# EAGLE design Module_Motor_DC (EAGLE 9.6.2)
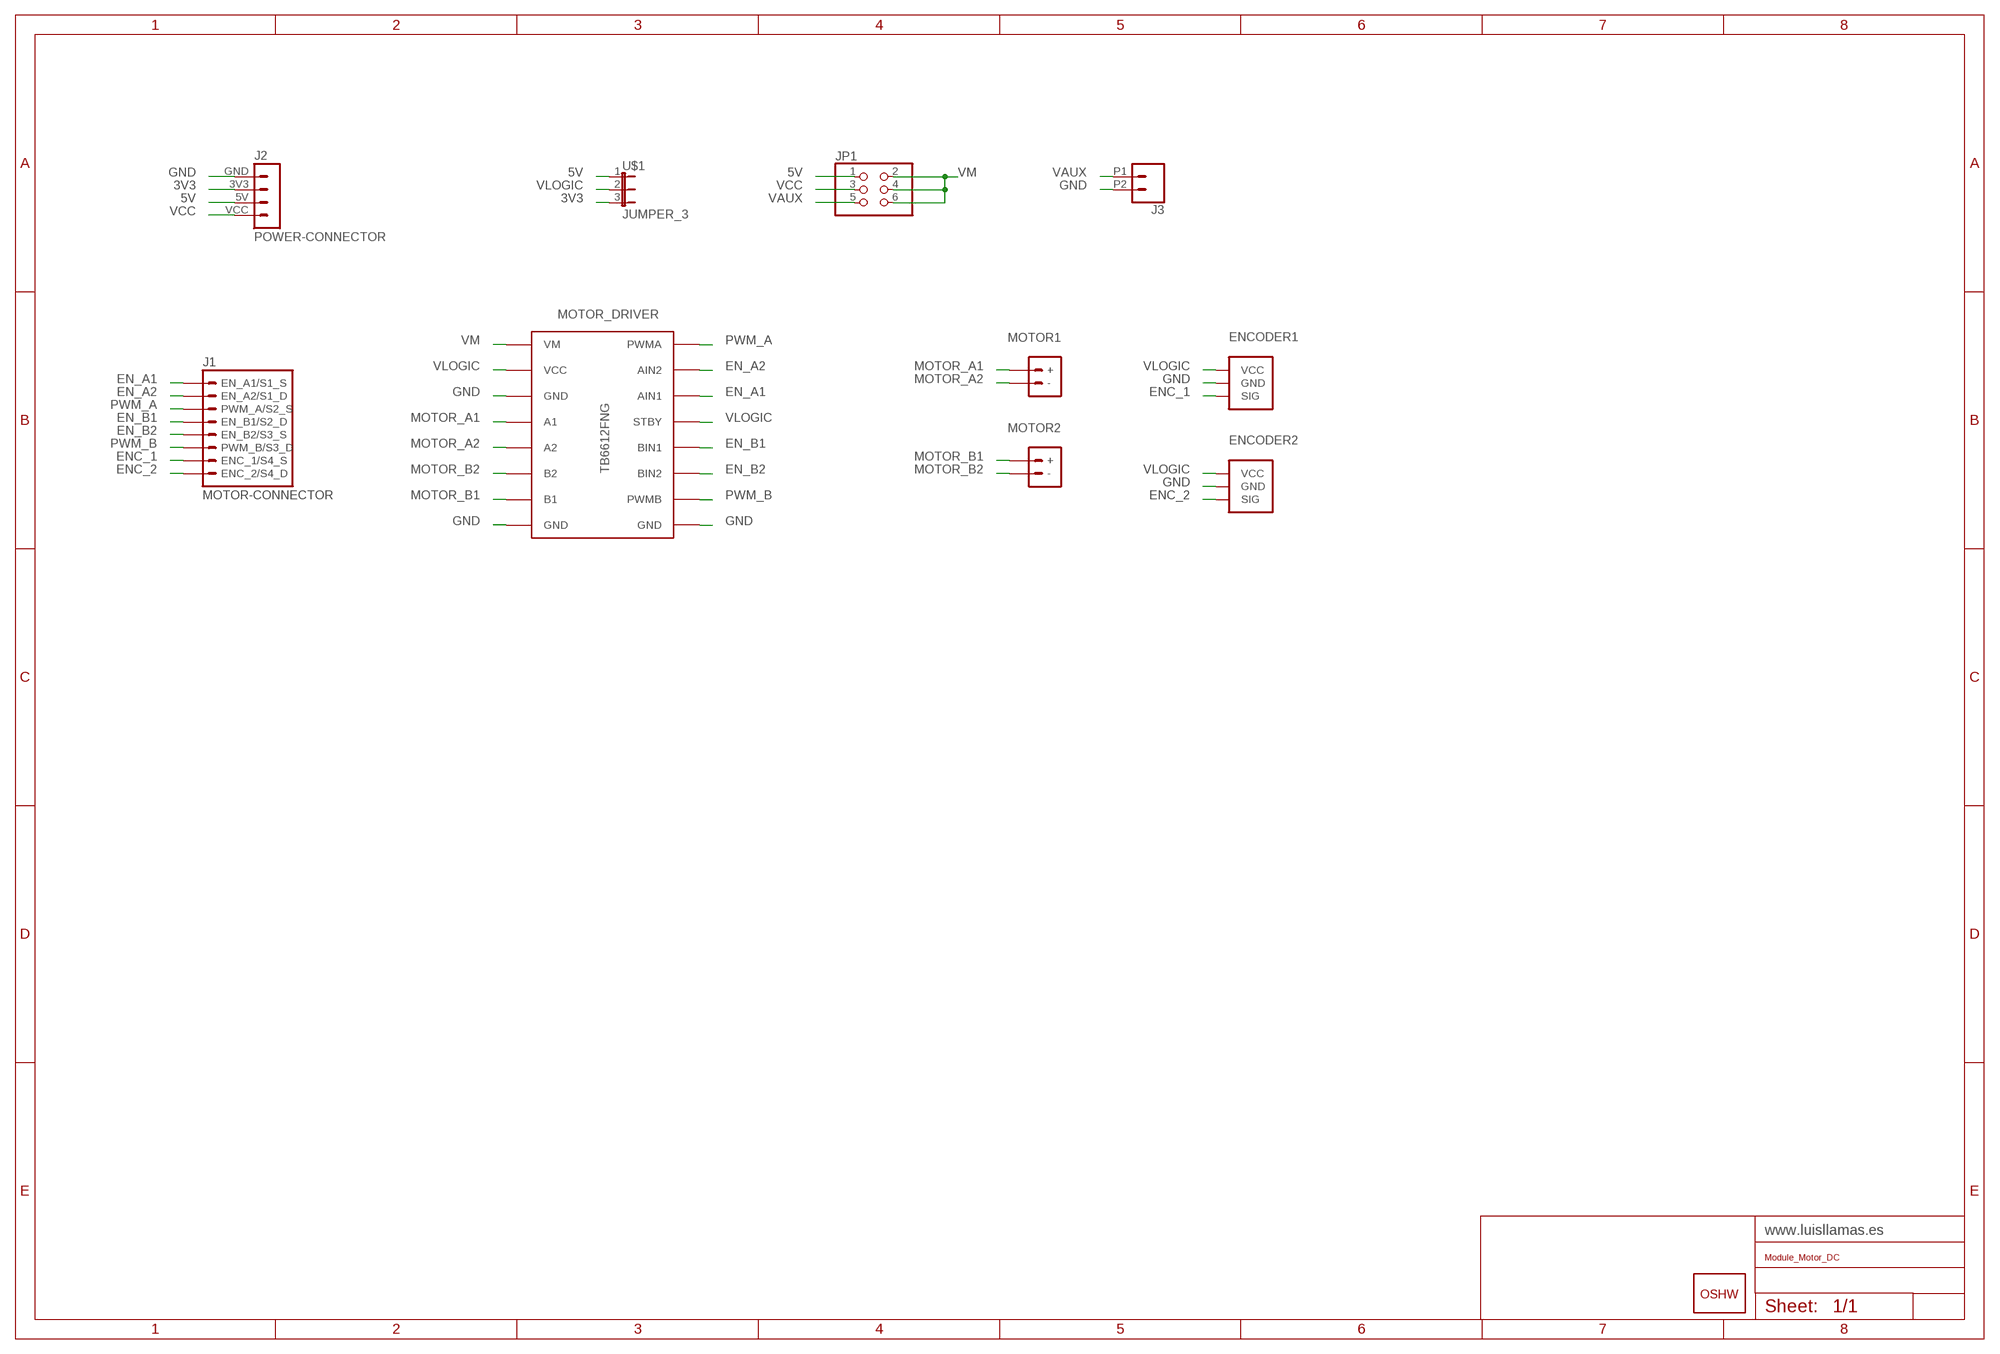
[diagram p0: schematic, sheet 1]

## Parts
ENCODER1  ENCODER/OCT  [ENCODER]
ENCODER2  ENCODER/OCT  [ENCODER]
GOLD_ORB_SM1  OSHWLOGO_GOLD_ORB_MED  [OSHW1]
J1  MOTOR-CONNECTOR  [MOTOR-CONNECTOR]
J2  POWER-CONNECTOR  [POWER-CONNECTOR]
J3  CONN_022.54MM_SCREWTERM  [1X02_2.54_SCREWTERM]
JP1  JUMPER_3X2/OCT  [JUMPER_3X2]
MOTOR1  MOTOR-TERMINAL5MM  [SCREWTERMINAL-5MM-2]
MOTOR2  MOTOR-TERMINAL5MM  [SCREWTERMINAL-5MM-2]
MOTOR_DRIVER  TB6612FNG  [TB6612FNG]
U$1  JUMPER_3  [JUMPER_3]

## Nets
3V3: J2.3V3 U$1.3
5V: J2.5V JP1.1 U$1.1
EN_A1: J1.EN_A1/S1_S MOTOR_DRIVER.AIN1
EN_A2: J1.EN_A2/S1_D MOTOR_DRIVER.AIN2
EN_B1: J1.EN_B1/S2_D MOTOR_DRIVER.BIN1
EN_B2: J1.EN_B2/S3_S MOTOR_DRIVER.BIN2
ENC_1: ENCODER1.SIG J1.ENC_1/S4_S
ENC_2: ENCODER2.SIG J1.ENC_2/S4_D
GND: ENCODER1.GND ENCODER2.GND J2.GND J3.P2 MOTOR_DRIVER.GND1(GND) MOTOR_DRIVER.GND2(GND) MOTOR_DRIVER.GND3(GND)
MOTOR_A1: MOTOR1.+ MOTOR_DRIVER.A1
MOTOR_A2: MOTOR1.- MOTOR_DRIVER.A2
MOTOR_B1: MOTOR2.+ MOTOR_DRIVER.B1
MOTOR_B2: MOTOR2.- MOTOR_DRIVER.B2
PWM_A: J1.PWM_A/S2_S MOTOR_DRIVER.PWMA
PWM_B: J1.PWM_B/S3_D MOTOR_DRIVER.PWMB
VAUX: J3.P1 JP1.5
VCC: J2.VCC JP1.3
VLOGIC: ENCODER1.VCC ENCODER2.VCC MOTOR_DRIVER.STBY MOTOR_DRIVER.VCC U$1.2
VM: JP1.2 JP1.4 JP1.6 MOTOR_DRIVER.VM

## Library data of the parts
ENCODER1 ENCODER2 = LLL_Headers:ENCODER: Header for Servo
GOLD_ORB_SM1 = LLL_Frames:OSHWLOGO: These are Open-Source Hardware logos.
J1 = LLL_Motors:MOTOR-CONNECTOR: MOTOR CONNECTOR 8p DC Motor EN_A1 EN_A2 PWM_A EN_B1 EN_B2 PWM_B ENC_1 ENC_2 Stepper STEP1_S STEP1_D STEP2_S STEP2_D STEP3_S STEP3_D STEP4_S STEP4_D
J2 = LLL_Power:POWER-CONNECTOR: JST Connector
J3 = LLL_Connectors:CONN_02: Multi connection point. Often used as Generic Header-pin footprint for 0.1 inch spaced/style header connections On any of the 0.1 inch spaced packages, you can populate with these: Break Away Headers - Straight <https://www.sparkfun.com/products/116> (PRT-00116) Break Away Male Headers - Right Angle <https://www.sparkfun.com/products/553> (PRT-00553) Female Headers <https://www.sparkfun.com/products/115> (PRT-00115) Break Away Headers - Machine Pin <https://www.sparkfun.com/products/117> (PRT-00117) Break Away Female Headers - Swiss Machine Pin <https://www.sparkfun.com/products/743> (PRT-00743) For SCREWTERMINALS and SPRING TERMINALS visit here: Screw Terimnals on SparkFun.com <https://www.sparkfun.com/search/results?term=Screw+Terminals> (5mm/3.5mm/2.54mm spacing) This device is also useful as a general connection point to wire up your design to another part of your project. Our various solder wires solder well into these plated through hole pads. Hook-Up Wire - Assortment (Stranded, 22 AWG) <https://www.sparkfun.com/products/11375> (PRT-11375) Hook-Up Wire - Assortment (Solid Core, 22 AWG) <https://www.sparkfun.com/products/11367> (PRT-11367) View the entire wire category on our website here <https://www.sparkfun.com/categories/141> Special notes: Molex polarized connector foot print use with: PRT-08233 with associated crimp pins and housings. 2.54_SCREWTERM for use with PRT-10571. 3.5mm Screw Terminal footprints for PRT-08084 5mm Screw Terminal footprints for use with PRT-08432
JP1 = LLL_Jumpers:JUMPER_3X2: Header ISR
MOTOR1 MOTOR2 = LLL_Motors:MOTOR-TERMINAL: MOTOR TERMINAL - DC MOTOR; SF_SKU: PRT-08432
MOTOR_DRIVER = LLL_Motors:TB6612FNG
U$1 = LLL_Jumpers:JUMPER_3

## Net classes
0 default: clearance 0.205 mm

## Board
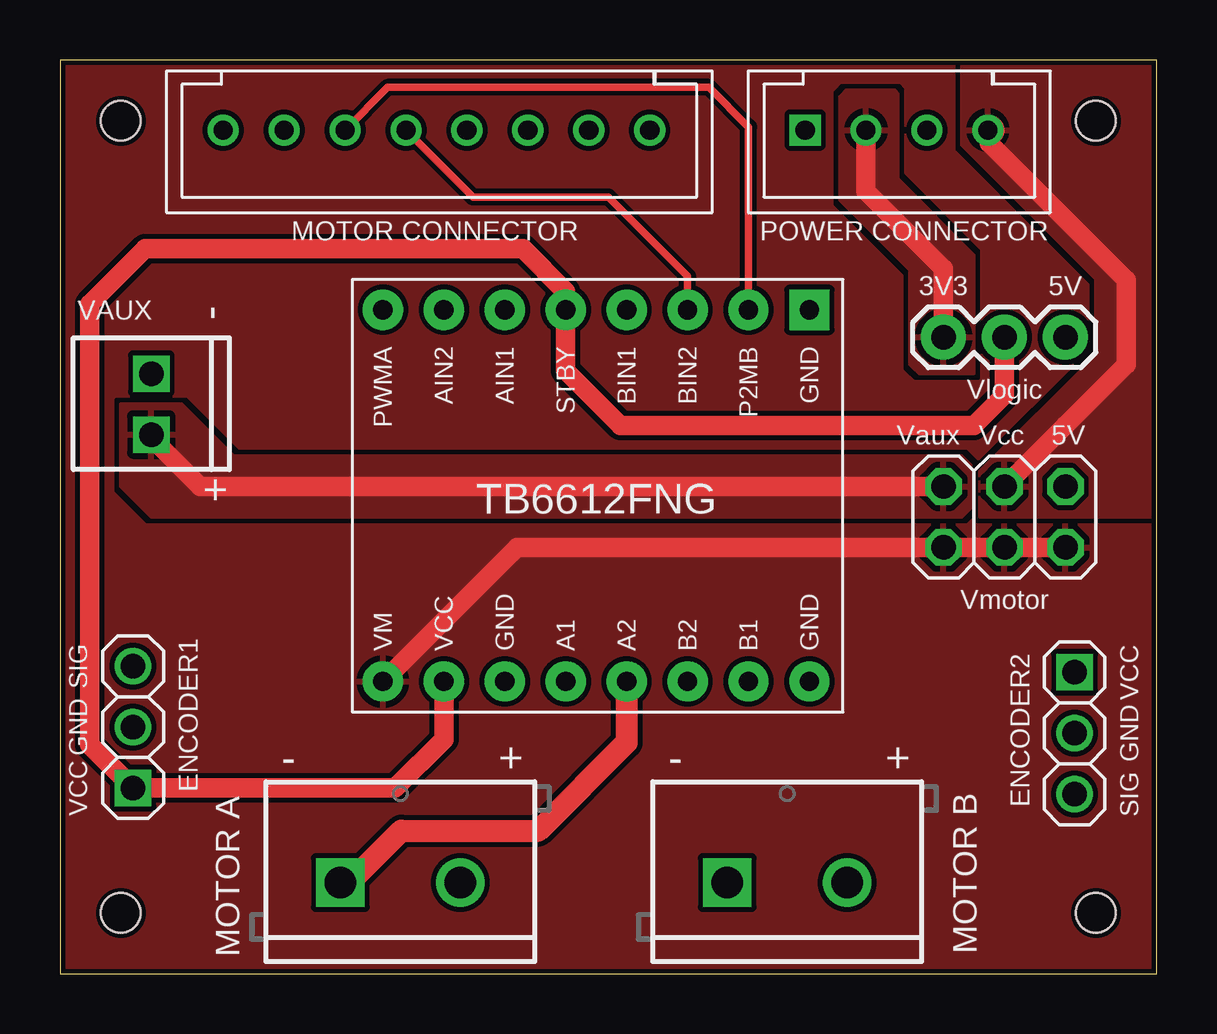
[diagram p1: board, top side]
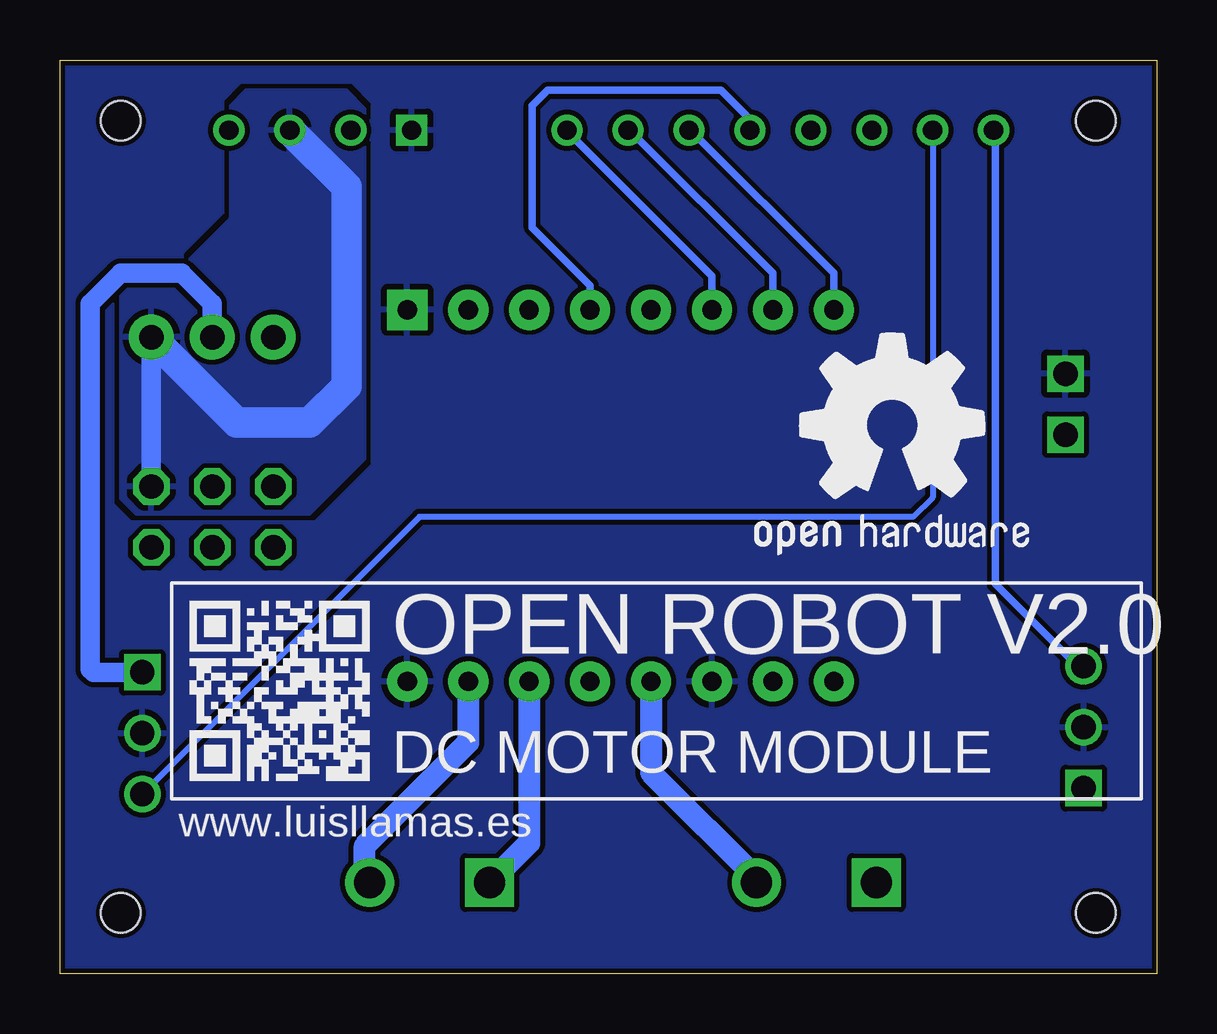
[diagram p2: board, bottom side, seen from below]

Size 45.72 x 38.1 mm. Coordinates in mm from the lower left corner, seen from the top.
Outline: 0,38.1 0,0 45.72,0 45.72,38.1 0,38.1
Copper layers (1*16): Top 0.035559375mm / dielectric 1.6mm / Bottom 0.035559375mm
Design rules "jlcpcb2layer": minimum track width 5mil, minimum drill 12mil, track to track 5mil, track to pad 5mil, pad to pad 5mil, via to via 5mil, smd to smd 5mil, copper to edge 8mil, drill to drill 6mil, minimum pad ring 5mil, minimum via ring 3mil, stop-mask expansion 2.5mil, vias tented up to drill 0mil, thermal gap 10mil
Holes 1.65 mm at 2.54,35.56 2.54,2.54 43.18,35.56 43.18,2.54

### Footprints (pad centres in the part's own frame; a part is rotated, then mirrored left to right if it is on the bottom)
ENCODER = drill 1.016: GND 2.54,0; SIG 5.08,0 | drill 1.016 square: VCC 0,0
MOTOR-CONNECTOR = drill 0.8 pad 1.3: EN_A1/S1_S 0,-8.834; EN_A2/S1_D 0,-6.294; EN_B1/S2_D 0,-1.214; EN_B2/S3_S 0,1.326; ENC_1/S4_S 0,6.406; ENC_2/S4_D 0,8.946; PWM_A/S2_S 0,-3.754; PWM_B/S3_D 0,3.866
POWER-CONNECTOR = drill 0.8 pad 1.3: 3V3 0,1.326; 5V 0,-1.214; VCC 0,-3.754 | drill 0.8 pad 1.3 square: GND 0,3.866
1X02_2.54_SCREWTERM = drill 1.016 square: P1 2.54,0; P2 0,0
JUMPER_3X2 = drill 1.016 octagon: 1 -2.54,-1.27; 2 -2.54,1.27; 3 0,-1.27; 4 0,1.27; 5 2.54,-1.27; 6 2.54,1.27
SCREWTERMINAL-5MM-2 = drill 1.3 pad 2.032: + 5,0 | drill 1.3 pad 2.032 square: - 0,0
TB6612FNG = drill 0.8 pad 1.676: A1 -7.62,1.27; A2 -7.62,-1.27; AIN1 7.874,3.81; AIN2 7.874,6.35; B1 -7.62,-6.35; B2 -7.62,-3.81; BIN1 7.874,-1.27; BIN2 7.874,-3.81; GND1 -7.62,3.81; GND2 -7.62,-8.89; PWMA 7.874,8.89; PWMB 7.874,-6.35; STBY 7.874,1.27; VCC -7.62,6.35; VM -7.62,8.89 | drill 0.8 pad 1.676 square: GND3 7.874,-8.89
JUMPER_3 = drill 1.016 pad 1.88: 1 0,0; 2 2.54,0; 3 5.08,0

### Placement (x,y rotation side)
ENCODER1  42.29,12.57 270 top
ENCODER2  3.05,7.75 90 top
GOLD_ORB_SM1  17.4,15.75 0 bottom
J1  15.75,35.18 90 top
J2  34.92,35.18 90 top
J3  3.81,25.02 270 top
JP1  39.37,19.05 180 top
MOTOR1  11.68,3.81 0 top
MOTOR2  27.81,3.81 0 top
MOTOR_DRIVER  22.35,19.81 90 top
U$1  41.91,26.54 180 top

### Tracks (layer width: path | path; a pad name or v marks a point on that pad's centre or on a via)
3V3
  Top 0.813: J2.3V3 33.6,32.64 36.83,29.41 U$1.3
  pour Top: 33.02,36.83 34.8,36.83 34.92,36.7 34.92,33.15 38.1,29.97 38.1,29.72 38.1,25.02 35.81,25.02 35.56,25.27 35.43,25.4 35.43,29.34 32.51,32.26 32.51,32.51 32.51,36.58 32.64,36.7 32.77,36.83
5V
  Bottom 0.813: U$1.1 JP1.1
  Bottom 1.27: J2.5V 33.78,32.82 33.78,24.51 35.31,22.99 38.35,22.99 U$1.1
  pour Bottom: 43.18,29.21 43.18,19.81 42.55,19.18 35.31,19.18 33.02,21.46 33.02,36.07 33.78,36.83 37.97,36.83 38.61,36.2 38.61,31.5 40.89,29.21
EN_A1
  Bottom 0.305: J1.EN_A1/S1_S 24.58,35.12 18.54,29.08 MOTOR_DRIVER.AIN1
EN_A2
  Bottom 0.305: J1.EN_A2/S1_D 21.97,35.18 16,29.21 MOTOR_DRIVER.AIN2
EN_B1
  Bottom 0.305: J1.EN_B1/S2_D 16.96,35.63 18.16,36.83 25.4,36.83 26.04,36.2 26.04,31.11 23.62,28.7 MOTOR_DRIVER.BIN1
EN_B2
  Top 0.305: J1.EN_B2/S3_S 17.22,32.38 22.86,32.38 26.16,29.08 MOTOR_DRIVER.BIN2
ENC_1
  Bottom 0.254: J1.ENC_1/S4_S 9.34,19.87 10.16,19.05 30.73,19.05 ENCODER1.SIG
ENC_2
  Bottom 0.305: J1.ENC_2/S4_D 6.73,35.11 6.73,16.26 3.3,12.83 ENCODER2.SIG
GND
  pour Bottom (rank 2): 0,0 0,38.1 45.72,38.1 45.72,0
MOTOR_A1
  Bottom 0.914: MOTOR_DRIVER.A1 21.08,8.38 16.51,3.81 MOTOR1.+
MOTOR_A2
  Top 0.914: MOTOR_DRIVER.A2 23.62,9.65 19.94,5.97 14.22,5.97 12.06,3.81 MOTOR1.-
MOTOR_B1
  Bottom 0.914: MOTOR_DRIVER.B1 28.7,9.65 33.02,5.33 33.02,3.81 MOTOR2.+
MOTOR_B2
  Bottom 0.914: MOTOR_DRIVER.B2 26.16,5.46 MOTOR2.-
PWM_A
  Bottom 0.305: J1.PWM_A/S2_S 19.43,35.18 13.46,29.21 MOTOR_DRIVER.PWMA
PWM_B
  Top 0.305: J1.PWM_B/S3_D 13.66,36.96 27.05,36.96 28.7,35.31 MOTOR_DRIVER.PWMB
VAUX
  Top 0.813: JP1.5 5.84,20.32 3.81,22.35 J3.P1
  pour Top: 2.54,23.75 5.08,23.75 7.24,21.59 37.59,21.59 37.97,21.21 37.97,19.43 37.59,19.05 3.81,19.05 2.54,20.32
VCC
  Top 0.813: 38.73,35.18 38.73,34.63 44.45,28.92 44.45,25.4 41.91,22.86 JP1.3
  Top 1.27: 38.73,35.18 J2.VCC
  pour Top: 37.59,38.1 45.72,38.1 45.72,19.05 38.35,19.05 38.35,20.95 43.18,25.78 43.18,28.96 37.59,34.54
VLOGIC
  Top 0.813: U$1.2 39.37,24.13 38.1,22.86 23.37,22.86 21.08,25.15 MOTOR_DRIVER.STBY 21.08,28.45 19.3,30.23 3.56,30.23 1.25,27.91 1.25,9.55 ENCODER2.VCC 13.97,7.75 16,9.78 MOTOR_DRIVER.VCC
  Bottom 0.813: U$1.2 39.37,27.94 40.64,29.21 43.18,29.21 44.45,27.94 44.45,12.7 44.32,12.57 ENCODER1.VCC
VM
  Top 0.813: JP1.2 JP1.4 JP1.6 19.05,17.78 MOTOR_DRIVER.VM
  pour Top (rank 2): 0,0 0,38.1 45.72,38.1 45.72,0

### Text on the board
tPlace: MOTOR CONNECTOR | POWER CONNECTOR | 3V3 | 5V | VAUX | - | Vlogic | Vaux | Vcc | 5V | + | Vmotor | ENCODER1 | ENCODER2 | MOTOR A | MOTOR B
bPlace: OPEN ROBOT V2.0 | DC MOTOR MODULE | www.luisllamas.es